# Altium schematic sheet 主机板.SchDoc
size A3
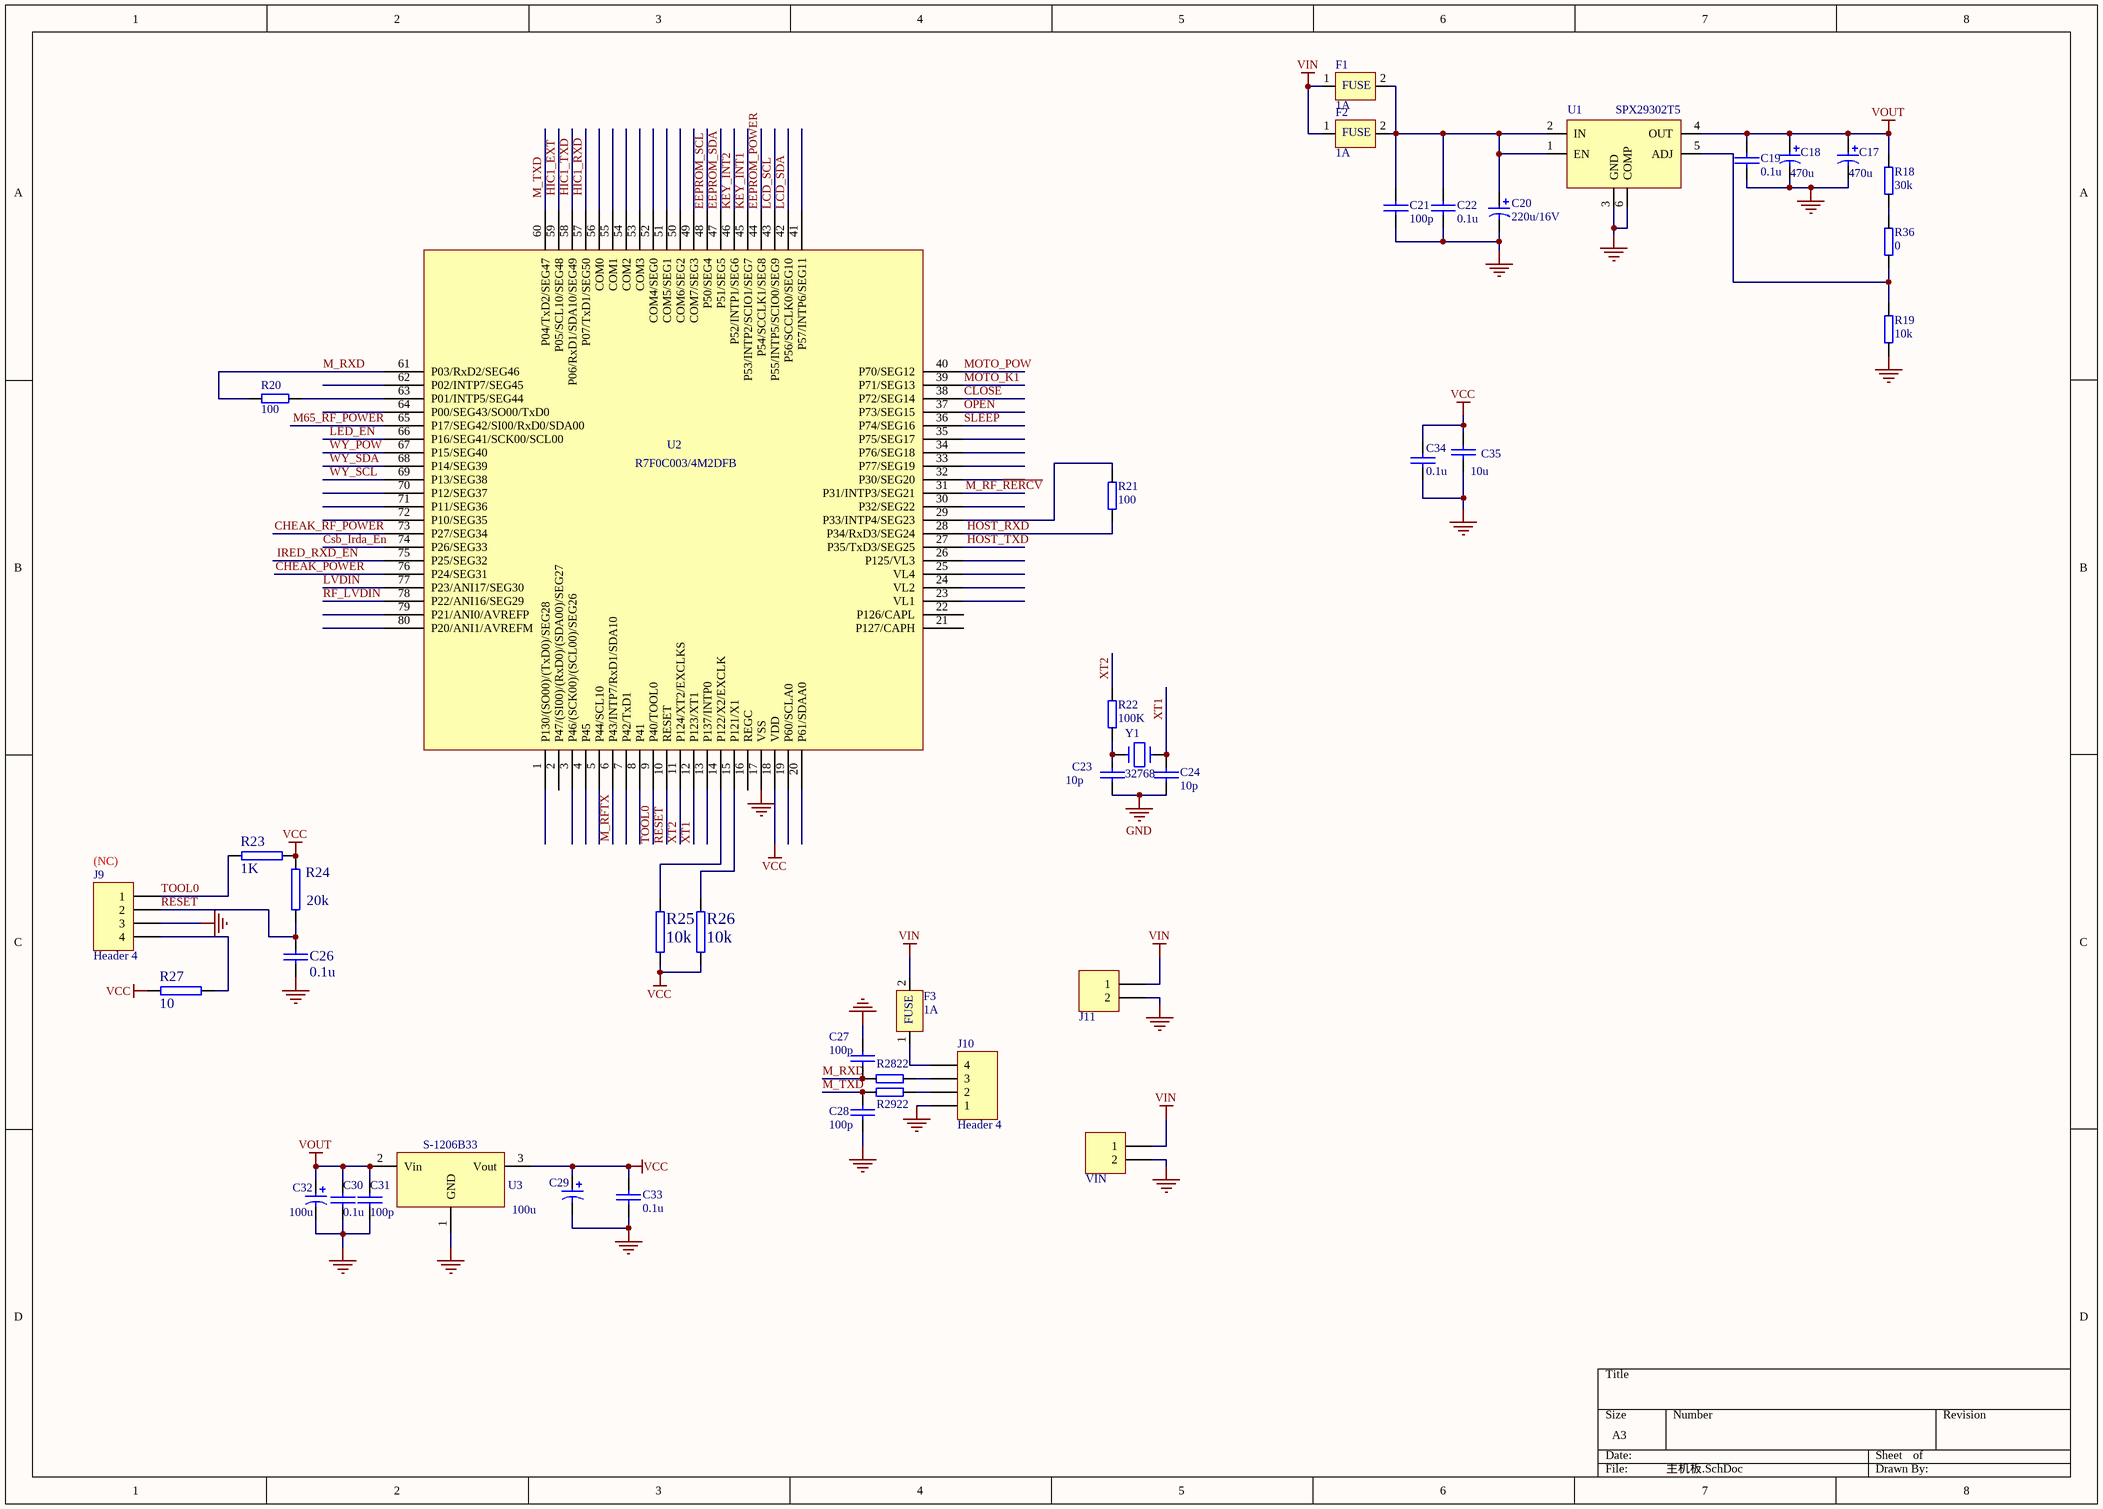
[diagram p0: 主机板.SchDoc]

## Parts
C17  470u  [7343]
C18  470u  [7343]
C19  0.1u  [C0603]
C20  220u/16V  [7343]
C21  100p  [C0603]
C22  0.1u  [C0603]
C23  10p  [c0603]
C24  10p  [c0603]
C26  0.1u  [C0603]
C27  100p  [C0603]
C28  100p  [C0603]
C29  100u  [3528]
C30  0.1u  [C0603]
C31  100p  [C0603]
C32  100u  [3528]
C33  0.1u  [C0603]
C34  0.1u  [C0603]
C35  10u  [C0603]
F1  1A  [R1206]
F2  1A  [R1206]
F3  1A  [R1206]
J9  Header 4  [HDR1X4]
J10  Header 4  [HDX4-2.54]
J11  Header 2  [SMT2-2.0]  (value not drawn)
R18  30k  [R0603]
R19  10k  [R0603]
R20  100  [r0603]
R21  100  [R0603]
R22  100K  [r0603]
R23  1K  [R0603]
R24  20k  [R0603]
R25  10k  [r0603]
R26  10k  [r0603]
R27  10  [R0603]
R28  22  [R0603]
R29  22  [R0603]
R36  0  [R0603]
U1  SPX29302T5  [TO-263-5]
U2  R7F0C003/4M2DFB  [MSP437QFP80]
U3  S-1206B33  [SOT-89]
VIN  Header 2  [BATFOOT]  (value not drawn)
Y1  32768  [XTAL-2S]

## Nets
GND: C17.2 C18.2 C19.1 C20.2 C21.1 C22.1 C23.1 C24.1 C26.1 C27.1 C28.1 C29.2 C30.1 C31.1 C32.2 C33.1 C34.2 C35.2 J9.3 J10.1 J11.2 R19.1 U1.3(GND) U1.6(COMP) U2.17(VSS) U3.1(GND) VIN.2
VCC: C29.1 C33.2 C34.1 C35.1 R23.2 R24.1 R25.2 R26.2 R27.1 U2.18(VDD) U3.3(Vout)
VIN: F1.1(I) F2.1(I) F3.2(I) J11.1 VIN.1
VOUT: C17.1 C18.1 C19.2 C30.2 C31.2 C32.1 R18.2 U1.4(OUT) U3.2(Vin)
CHEAK_POWER: U2.76(P24/SEG31)
CHEAK_RF_POWER: U2.73(P27/SEG34)
CLOSE: U2.38(P72/SEG14)
Csb_Irda_En: U2.74(P26/SEG33)
EEPROM_POWER: U2.44(P54/SCCLK1/SEG8)
EEPROM_SCL: U2.48(P50/SEG4)
EEPROM_SDA: U2.47(P51/SEG5)
HIC1_EXT: U2.59(P05/SCL10/SEG48)
HIC1_RXD: U2.57(P07/TxD1/SEG50)
HIC1_TXD: U2.58(P06/RxD1/SDA10/SEG49)
HOST_RXD: R21.1 U2.28(P34/RxD3/SEG24)
HOST_TXD: U2.27(P35/TxD3/SEG25)
IRED_RXD_EN: U2.75(P25/SEG32)
KEY_INT1: U2.45(P53/INTP2/SCIO1/SEG7)
KEY_INT2: U2.46(P52/INTP1/SEG6)
LCD_SCL: U2.43(P55/INTP5/SCIO0/SEG9)
LCD_SDA: U2.42(P56/SCCLK0/SEG10)
LED_EN: U2.66(P16/SEG41/SCK00/SCL00)
LVDIN: U2.77(P23/ANI17/SEG30)
M65_RF_POWER: U2.65(P17/SEG42/SI00/RxD0/SDA00)
M_RF_~{RERCV}: U2.31(P31/INTP3/SEG21)
M_RFTX: U2.6(P43/INTP7/RxD1/SDA10)
M_RXD: C27.2 R20.2 R28.1 U2.61(P03/RxD2/SEG46)
M_TXD: C28.2 R29.2 U2.60(P04/TxD2/SEG47)
MOTO_K1: U2.39(P71/SEG13)
MOTO_POW: U2.40(P70/SEG12)
OPEN: U2.37(P73/SEG15)
RESET: C26.2 J9.2 R24.2 U2.10(RESET)
RF_LVDIN: U2.78(P22/ANI16/SEG29)
SLEEP: U2.36(P74/SEG16)
TOOL0: J9.1 R23.1 U2.9(P40/TOOL0)
WY_POW: U2.67(P15/SEG40)
WY_SCL: U2.69(P13/SEG38)
WY_SDA: U2.68(P14/SEG39)
XT1: C24.2 U2.12(P123/XT1) Y1.1
XT2: R22.2 U2.11(P124/XT2/EXCLKS)
NetC20_1: C20.1 C21.2 C22.2 F1.2(I) F2.2(I) U1.1(EN) U1.2(IN)
NetC23_2: C23.2 R22.1 Y1.2
NetF3_1: F3.1(I) J10.4
NetJ9_4: J9.4 R27.2
NetJ10_2: J10.2 R29.1
NetJ10_3: J10.3 R28.2
NetR18_1: R18.1 R36.2
NetR19_2: R19.2 R36.1 U1.5(ADJ)
NetR20_1: R20.1 U2.63(P01/INTP5/SEG44)
NetR21_2: R21.2 U2.29(P33/INTP4/SEG23)
NetR25_1: R25.1 U2.14(P122/X2/EXCLK)
NetR26_1: R26.1 U2.15(P121/X1)

Not connected (* = marked no-connect by the designer): U2 1(P130/(SO00)/(TxD0)/SEG28) 2(P47/(SI00)/(RxD0)/(SDA00)/SEG27) 3(P46/(SCK00)/(SCL00)/SEG26) 4(P45) 5(P44/SCL10) 7(P42/TxD1) 8(P41) 13(P137/INTP0) 16(REGC) 19(P60/SCLA0) 20(P61/SDAA0) 21(P127/CAPH) 22(P126/CAPL) 23(VL1) 24(VL2) 25(VL4) 26(P125/VL3) 30(P32/SEG22) 32(P30/SEG20) 33(P77/SEG19) 34(P76/SEG18) 35(P75/SEG17) 41(P57/INTP6/SEG11) 49(COM7/SEG3) 50(COM6/SEG2) 51(COM5/SEG1) 52(COM4/SEG0) 53(COM3) 54(COM2) 55(COM1) 56(COM0) 62(P02/INTP7/SEG45) 64(P00/SEG43/SO00/TxD0) 70(P12/SEG37) 71(P11/SEG36) 72(P10/SEG35) 79(P21/ANI0/AVREFP) 80(P20/ANI1/AVREFM)

## Notes on the sheet
- (near J9) (NC)

## Library data of the parts
C17 C18 C20 C29 C32 = CAP-POL2: 钽电容
C19 C21 C22 C27 C28 C30 C31 C33-C35 = CAP: 无极性电容
C23 C24 = CAP1
C26 = CAP: Capacitor
F1-F3 = FUSE
J9 J10 = Header 4: Header, 4-Pin; LatestRevisionDate: 17-Jul-2002; LatestRevisionNote: Re-released for DXP Platform.; Publisher: Altium Limited
J11 VIN = Header 2: Header, 2-Pin
R18-R22 R28 R29 R36 = RES
R23 R24 R27 = RES11
R25 R26 = RES2
U1 = SPX29302T5: Value: 1K; Published: 8-Jun-2000; LatestRevisionDate: 04-Mar-2005; LatestRevisionNote: PCB Footprint replaced.; PackageReference: J1-0603; Publisher: Altium Limited
U3 = VOLTRER1
Y1 = XTAL1: 晶振,2PIN